# EAGLE design rosscomp_th (EAGLE 9.1.3)
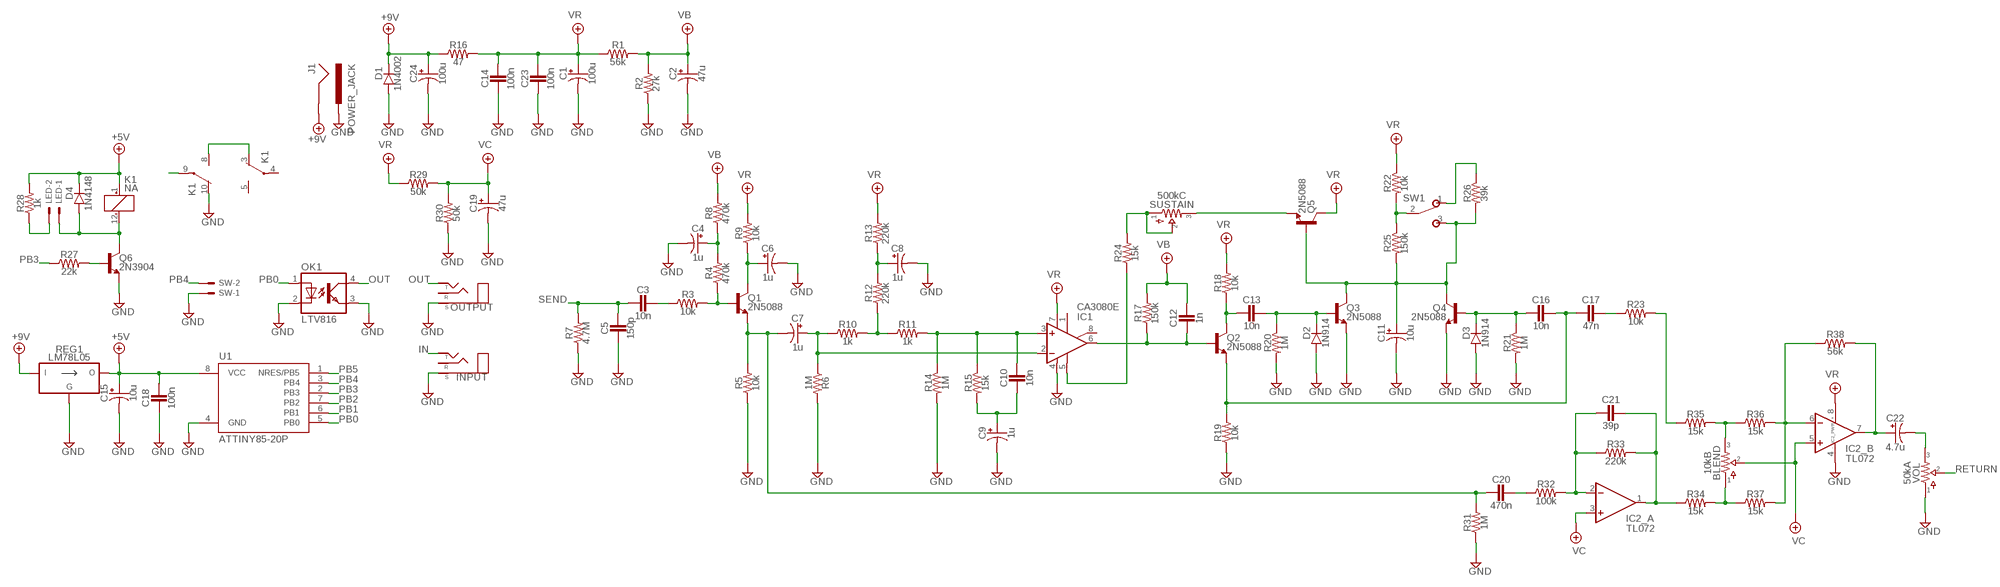
[diagram p0: schematic, sheet 1]

## Parts
BLEND  10kB  POTS16MM  [16MM]
C1  100u  0500  [050_020]
C2  47u  0500  [050_020]
C3  10n  CER/FILMBOX.1  [BOX_SMALL]
C4  1u  0400  [040_020]
C5  150p  CER/FILM2  [050X030_025_2]
C6  1u  0400  [040_020]
C7  1u  0400  [040_020]
C8  1u  0400  [040_020]
C9  1u  0400  [040_020]
C10  10n  CER/FILMBOX.1  [BOX_SMALL]
C11  10u  0500  [050_020]
C12  1n  CER/FILMBOX.1  [BOX_SMALL]
C13  10n  CER/FILMBOX.1  [BOX_SMALL]
C14  100n  CER/FILM2  [050X030_025_2]
C15  10u  0500  [050_020]
C16  10n  CER/FILMBOX.1  [BOX_SMALL]
C17  47n  CER/FILMBOX.1  [BOX_SMALL]
C18  100n  CER/FILM2  [050X030_025_2]
C19  47u  0500  [050_020]
C20  470n  CER/FILMBOX.2  [BOX_MED]
C21  39p  CER/FILM2  [050X030_025_2]
C22  4.7u  0500  [050_020]
C23  100n  CER/FILM2  [050X030_025_2]
C24  100u  0500  [050_020]
D1  1N4002  DO41.2  [DO41-2]
D2  1N914  DO35.2  [DO35-2]
D3  1N914  DO35.2  [DO35-2]
D4  1N4148  DO35.2  [DO35-2]
IC1  CA3080E  3080TH  [DIL0]
IC2  TL072  DUALTH  [DIL0]
INPUT  STEREONMJ  [NMJ6HCD2]
J1  POWER_JACK  [POWER_JACK_PTH]
K1  NA  [NA]
LED  JST-XH-02-PIN-ROUND-PAD  [JST-XH-02-PACKAGE-ROUND-PAD]
OK1  LTV816  [DIL04]
OUTPUT  STEREONMJ  [NMJ6HCD2]
Q1  2N5088  [TO92-]
Q2  2N5088  [TO92-]
Q3  2N5088  [TO92-]
Q4  2N5088  [TO92-]
Q5  2N5088  [TO92-]
Q6  2N3904  [TO92-]
R1  56k  R_.3B  [R0207/3]
R2  27k  R_.3B  [R0207/3]
R3  10k  R_.3B  [R0207/3]
R4  470k  R_.3B  [R0207/3]
R5  10k  R_.3B  [R0207/3]
R6  1M  R_.3B  [R0207/3]
R7  4.7M  R_.3B  [R0207/3]
R8  470k  R_.3B  [R0207/3]
R9  10k  R_.3B  [R0207/3]
R10  1k  R_.3B  [R0207/3]
R11  1k  R_.3B  [R0207/3]
R12  220k  R_.3B  [R0207/3]
R13  220k  R_.3B  [R0207/3]
R14  1M  R_.3B  [R0207/3]
R15  15k  R_.3B  [R0207/3]
R16  47  R_.3B  [R0207/3]
R17  150k  R_.3B  [R0207/3]
R18  10k  R_.3B  [R0207/3]
R19  10k  R_.3B  [R0207/3]
R20  1M  R_.3B  [R0207/3]
R21  1M  R_.3B  [R0207/3]
R22  10k  R_.3B  [R0207/3]
R23  10k  R_.3B  [R0207/3]
R24  15k  R_.3B  [R0207/3]
R25  150k  R_.3B  [R0207/3]
R26  39k  R_.3B  [R0207/3]
R27  22k  R_.3B  [R0207/3]
R28  1k  R_.3B  [R0207/3]
R29  50k  R_.3B  [R0207/3]
R30  50k  R_.3B  [R0207/3]
R31  1M  R_.3B  [R0207/3]
R32  100k  R_.3B  [R0207/3]
R33  220k  R_.3B  [R0207/3]
R34  15k  R_.3B  [R0207/3]
R35  15k  R_.3B  [R0207/3]
R36  15k  R_.3B  [R0207/3]
R37  15k  R_.3B  [R0207/3]
R38  56k  R_.3B  [R0207/3]
REG1  LM78L05  [TO92-]
SUSTAIN  500kC  POTS16MM  [16MM]
SW  JST-XH-02-PIN-ROUND-PAD  [JST-XH-02-PACKAGE-ROUND-PAD]
SW1  SPDT  [M9040P]
U1  ATTINY85-20P  [PDIP08_300MIL]
VOL  50kA  POTS16MM  [16MM]

## Nets
+5V: C15.+ C18.1 D4.C K1.1(1:+) R28.2 REG1.3(VO) U1.8(VCC)
+9V: C24.+ D1.C J1.GND R16.1 REG1.1(VI)
GND: C1.- C2.- C4.- C5.2 C6.- C8.- C9.- C11.- C14.1 C15.- C18.2 C19.- C23.1 C24.- D1.A D2.A D3.A IC1.4(V-) IC2.4(_PWR:V-) INPUT.S J1.PWR K1.10(3:O) OK1.2(C) OK1.3(EMIT) OUTPUT.S Q3.3(E) Q4.3(E) Q6.3(E) R2.1 R5.1 R6.2 R7.1 R14.2 R19.1 R20.2 R21.2 R30.1 R31.1 REG1.2(GND) SW.1 U1.4(GND) VOL.1
IN: INPUT.T
N$1: D4.A K1.12(1:-) LED.1 Q6.1(C)
N$2: C3.1 R3.1
N$3: Q1.2(B) R3.2 R4.1
N$4: Q6.2(B) R27.2
N$5: C4.+ R4.2 R8.1
N$6: R26.1 SW1.1(O)
N$7: C6.+ Q1.1(C) R9.1
N$8: C7.+ IC1.2(-IN) R6.1 R10.1
N$9: C7.- C20.2 Q1.3(E) R5.2 R31.2
N$10: C10.1 IC1.3(+IN) R11.2 R14.1 R15.1
N$11: R10.2 R11.1 R12.1
N$12: C8.+ R12.2 R13.1
N$13: C9.+ C10.2 R15.2
N$14: C13.2 Q2.1(C) R18.1
N$15: C12.2 IC1.6(OUT) Q2.2(B) R17.1
N$16: C16.1 C17.2 Q2.3(E) R19.2
N$17: C13.1 D2.C Q3.2(B) R20.1
N$18: C11.+ Q3.1(C) Q4.1(C) Q5.2(B) R25.2 R26.2 SW1.3(S)
N$19: C16.2 D3.C Q4.2(B) R21.1
N$20: R22.2 R25.1 SW1.2(P)
N$21: C17.1 R23.1
N$22: C20.1 R32.1
N$23: Q5.3(E) SUSTAIN.3
N$24: LED.2 R28.1
N$25: R24.2 SUSTAIN.1 SUSTAIN.2
N$26: IC1.5(OPT) R24.1
N$27: K1.3(2:O) K1.8(3:S)
N$28: C21.2 IC2.2(_A:-IN) R32.2 R33.1
N$29: C21.1 IC2.1(_A:OUT) R33.2 R34.1
N$30: BLEND.1 R34.2 R37.1
N$31: BLEND.3 R35.2 R36.1
N$32: K1.9(3:P)
N$34: R23.2 R35.1
N$35: C22.+ IC2.7(_B:OUT) R38.2
N$36: C22.- VOL.3
N$37: IC2.6(_B:-IN) R36.2 R37.2 R38.1
OUT: OK1.4(COL) OUTPUT.T
PB0: OK1.1(A) U1.5(PB0)
PB1: U1.6(PB1)
PB2: U1.7(PB2)
PB3: R27.1 U1.2(PB3)
PB4: SW.2 U1.3(PB4)
PB5: U1.1(NRES/PB5)
RETURN: VOL.2
SEND: C3.2 C5.1 R7.2
VB: C2.+ C12.1 R1.2 R2.2 R8.2 R17.2
VC: BLEND.2 C19.+ IC2.3(_A:+IN) IC2.5(_B:+IN) R29.2 R30.2
VR: C1.+ C14.2 C23.2 IC1.7(V+) IC2.8(_PWR:V+) Q5.1(C) R1.1 R9.2 R13.2 R16.2 R18.2 R22.1 R29.1
Unconnected: IC1.1(ON1) IC1.8(ON2) INPUT.R K1.4(2:P) K1.5(2:S) OUTPUT.R

## Library data of the parts
BLEND SUSTAIN VOL = pedals-potentiometers:POTS
C1 C2 C11 C15 C19 C22 C24 = pedals-capacitors-elec:050
C3 C5 C10 C12-C14 C16-C18 C20 C21 C23 = pedals-capacitors-film:CER/FILM: 47 - 120pF Xicon Ceramic Disc 2.5mm lead spacing
C4 C6-C9 = pedals-capacitors-elec:040
D1 = pedals-diodes:DO41: DO-41 Package Diodes: 1N4001 - 1N40019 Zener Diodes: 1N4728 - 1N4764
D2-D4 = pedals-diodes:DO35: DO-35 Package Diodes: 1N914
IC1 = pedals-integrated circuits:3080: OP AMP
IC2 = pedals-integrated circuits:DUAL: OP AMP
INPUT OUTPUT = pedals-jacks:STEREO
J1 = pedals-jacks:POWER_JACK: Power Jack Connector This is the standard 5.5mm barrel jack for power. The PTH is the most common, proven, reliable, footprint. The Slot footprint only works if the mill layer is transmitted to the PCB fab house so be warned. Here are the connectors we sell at SparkFun: DC Barrel Power Jack/Connector <https://www.sparkfun.com/products/119> (PRT-00119) DC Barrel Power Jack/Connector (SMD) <https://www.sparkfun.com/products/12748> (PRT-12748) DC Barrel Jack Adapter - Breadboard Compatible <https://www.sparkfun.com/products/10811> (PRT-10811) It is used on this SparkFun product (and many, many others): SparkFun RedBoard - Programmed with Arduino <https://www.sparkfun.com/products/12757> (DEV-12757) Also, if you need a mating power supply or connector, please check these out: Wall Adapter Power Supply - 9VDC 650mA <https://www.sparkfun.com/products/298> (TOL-00298) DC Barrel Jack Adapter - Male <https://www.sparkfun.com/products/10287> (PRT-10287); PROD_ID: CONN-08197
K1 = pedals-relays:NA: RELAY; OC_FARNELL: unknown; OC_NEWARK: unknown
LED SW = pedals-headers:JST-XH-02-PIN: JST XH Connector 2 Pin Wire to board connector. Pitch: 2,54 mm, (0.100") Number of pins: 2 Created by Rembrandt Electronics www.rembrandtelectronics.com
OK1 = pedals-integrated circuits:LTV816: OPTO COUPLER Source: LITEON, LTV816.pdf; OC_FARNELL: unknown; OC_NEWARK: unknown
Q1-Q5 = pedals-transistors:2N5088: NPN Transistor
Q6 = pedals-transistors:2N3904: NPN Transistor
R1-R38 = pedals-resistors:R_
REG1 = pedals-regulators:LM78L05
SW1 = pedals-switches:SPDT: TOGGLE SWITCH Marquardt
U1 = pedals-microcontrollers:ATTINY85*: ATMEL ATtiny 85 Packages: P = PDIP 08 30mil S = SOIC 08 EIAJ 208mil Technologies Note: for complete ordering code (temp. range, finish, tape&reel etc.) see www.atmel.com • Supply Voltage: V = (1.8…5.5)V | [blank] = (2.7…5.5)V • Speed: 10 = 10 MHz | 20 = 20 MHz Author: Dipl.-Ing. FH Rainer Bayer HHN Hochschule Heilbronn (Heilbronn University), rainer.bayer@hs-heilbronn.de Ingenieurbüro ing-rb, mail@ing-rb.de

## Board
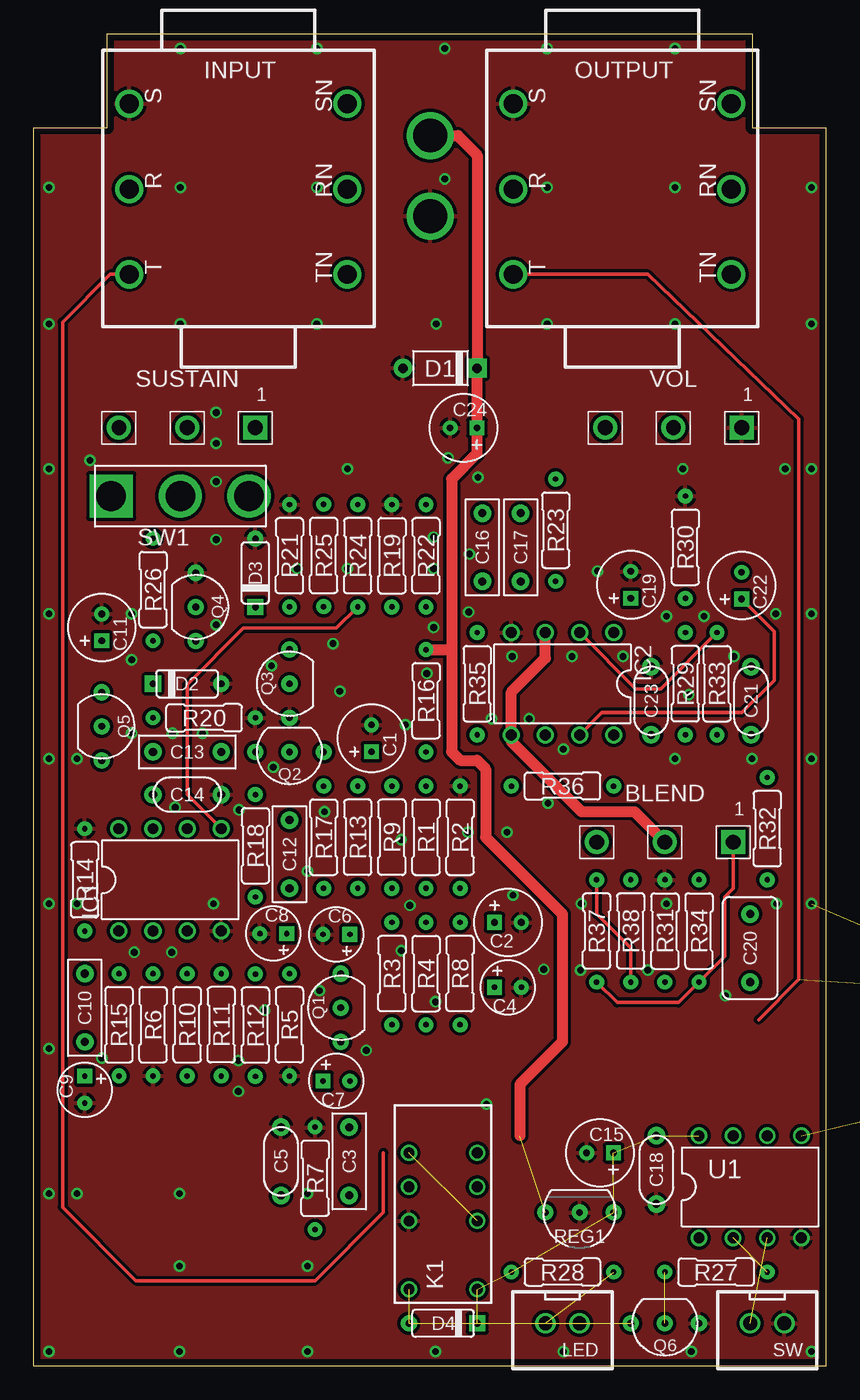
[diagram p1: board, top side]
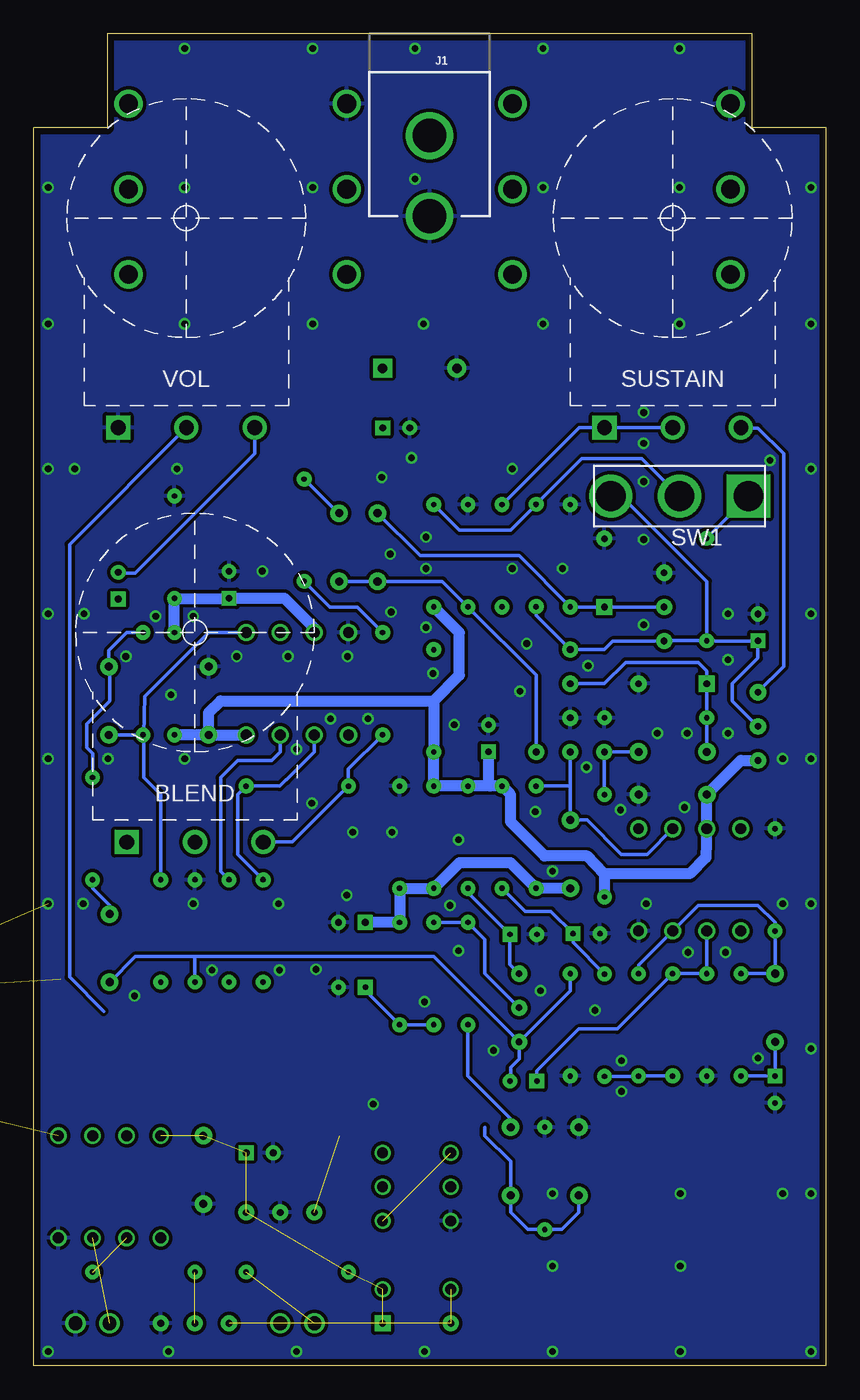
[diagram p2: board, bottom side, seen from below]

Size 59 x 99.21 mm. Coordinates in mm from the lower left corner, seen from the top.
Copper layers (1*16): Top 0.035mm / dielectric 1.6mm / Bottom 0.035mm
Design rules "Elecrow_2-layer_PCB_eagle_rule": minimum track width 6mil, minimum drill 12mil, track to track 6mil, track to pad 6mil, pad to pad 6mil, via to via 8mil, smd to smd 0mil, copper to edge 20mil, drill to drill 10mil, minimum pad ring 6mil, minimum via ring 6mil, stop-mask expansion 0mil, vias tented up to drill 100mil, thermal gap 10mil

### Footprints (pad centres in the part's own frame; a part is rotated, then mirrored left to right if it is on the bottom)
16MM = drill 1.1 pad 1.8 square: 1 5.08,-1 | drill 1.1 pad 1.8: 2 0,-1; 3 -5.08,-1
050_020 = drill 0.5 pad 1.1 square: + -0.998,0.001 | drill 0.5 pad 1.1: - 0.998,0.001
BOX_SMALL = drill 0.6 pad 1.3: 1 -2.54,0; 2 2.54,0
040_020 = drill 0.4 pad 1.1 square: + -1.001,0 | drill 0.4 pad 1.1: - 1.001,0
050X030_025_2 = drill 0.6 pad 1.3: 1 -2.54,0; 2 2.54,0
BOX_MED = drill 0.6 pad 1.3: 1 -2.54,0; 2 2.54,0
DO41-2 = drill 0.7 pad 1.4: A 2.794,0 | drill 0.7 pad 1.4 square: C -2.731,0
DO35-2 = drill 0.5 pad 1.2: A 2.54,0 | drill 0.5 pad 1.2 square: C -2.54,0
DIL0 = drill 0.813 pad 1.27: 1 -3.81,-3.81; 2 -1.27,-3.81; 3 1.27,-3.81; 4 3.81,-3.81; 5 3.81,3.81; 6 1.27,3.81; 7 -1.27,3.81; 8 -3.81,3.81
NMJ6HCD2 = drill 1.4: R 0,8.115; RN 0,-8.115; S 6.35,8.115; SN 6.35,-8.115; T -6.35,8.115; TN -6.35,-8.115
POWER_JACK_PTH = drill 2.5: GND 0,7.7; PWR 0,13.7
NA = drill 0.8: 1 -6.35,-2.54; 3 -1.27,-2.54; 4 1.27,-2.54; 5 3.81,-2.54; 8 3.81,2.54; 9 1.27,2.54; 10 -1.27,2.54; 12 -6.35,2.54
JST-XH-02-PACKAGE-ROUND-PAD = drill 1.016: 1 -1.27,0; 2 1.27,0
DIL04 = drill 0.813 pad 1.27: 1 -1.27,-3.81; 2 1.27,-3.81; 3 1.27,3.81; 4 -1.27,3.81
TO92- = drill 0.5 pad 1.2: 1 2.54,0; 2 0,0; 3 -2.54,0
R0207/3 = drill 0.4 pad 1.1: 1 -3.81,0; 2 3.81,0
TO92-' = drill 0.5 pad 1.194: 1 -2.54,0; 2 0,0; 3 2.54,0
M9040P = drill 2.2 pad 2.9 square: 1 5.144,0 | drill 2.2 pad 2.9: 2 0,0; 3 -5.118,0
PDIP08_300MIL = drill 0.813: 1 -3.81,-3.81; 2 -1.27,-3.81; 3 1.27,-3.81; 4 3.81,-3.81; 5 3.81,3.81; 6 1.27,3.81; 7 -1.27,3.81; 8 -3.81,3.81

### Placement (x,y rotation side)
BLEND  46.99,40.01 0 top
C1  25.15,46.74 90 top
C2  35.31,33.02 0 top
C3  23.5,15.24 270 top
C4  35.31,28.19 0 top
C5  18.41,15.24 90 top
C6  22.54,32.13 180 top
C7  22.54,21.21 0 top
C8  17.84,32.19 180 top
C9  3.81,20.57 270 top
C10  3.81,26.67 270 top
C11  5.08,54.99 90 top
C12  19.05,38.1 90 top
C13  11.43,45.72 0 top
C14  11.43,42.55 180 top
C15  42.16,15.88 180 top
C16  33.4,60.96 90 top
C17  36.26,60.96 270 top
C18  46.35,14.61 270 top
C19  44.45,58.17 90 top
C20  53.34,31.12 270 top
C21  53.4,49.53 90 top
C22  52.7,58.1 90 top
C23  45.97,49.53 270 top
C24  32,69.85 180 top
D1  30.29,74.3 180 top
D2  11.43,50.8 0 top
D3  16.51,59.05 90 top
D4  30.48,3.18 180 top
IC1  10.16,36.2 0 top
IC2  39.37,50.8 180 top
INPUT  15.24,87.63 90 top
J1  29.53,99.31 180 bottom
K1  30.48,12.07 90 top
LED  39.37,3.18 180 top
OK1  71.75,24.13 0 top  (outside the outline)
OUTPUT  43.81,87.63 90 top
Q1  22.86,26.67 90 top
Q2  19.05,45.72 180 top
Q3  19.05,50.8 90 top
Q4  12.06,56.52 270 top
Q5  5.08,47.62 270 top
Q6  46.99,3.18 180 top
R1  29.21,39.37 270 top
R2  31.75,39.37 270 top
R3  26.67,29.21 90 top
R4  29.21,29.21 270 top
R5  19.05,25.4 90 top
R6  8.89,25.4 270 top
R7  20.95,13.97 270 top
R8  31.75,29.21 90 top
R9  26.67,39.37 90 top
R10  11.43,25.4 270 top
R11  13.97,25.4 90 top
R12  16.51,25.38 90 top
R13  24.13,39.37 90 top
R14  3.81,36.2 90 top
R15  6.35,25.4 270 top
R16  29.21,49.53 270 top
R17  21.59,39.37 270 top
R18  16.51,38.73 270 top
R19  26.67,60.33 270 top
R20  12.7,48.26 0 top
R21  19.05,60.33 90 top
R22  29.21,60.33 90 top
R23  38.86,62.23 270 top
R24  24.13,60.33 90 top
R25  21.59,60.35 270 top
R26  8.89,57.81 270 top
R27  50.8,6.99 180 top
R28  39.37,6.99 180 top
R29  48.51,50.8 90 top
R30  48.51,60.96 270 top
R31  46.99,32.39 270 top
R32  54.61,40.01 90 top
R33  50.86,50.8 270 top
R34  49.53,32.39 270 top
R35  33.02,50.8 270 top
R36  39.37,43.18 0 top
R37  41.91,32.39 90 top
R38  44.45,32.39 90 top
REG1  LM78L05  [TO92-']  40.64,11.43 0 top
SUSTAIN  11.43,70.87 0 top
SW  54.61,3.18 180 top
SW1  10.92,64.77 180 top
U1  53.34,13.34 0 top
U$2  [125B_PCB_HUGER]  0,11.43 0 top
VOL  47.62,70.87 0 top

### Tracks (layer width: path | path; a pad name or v marks a point on that pad's centre or on a via)
+5V  (6 unrouted)
+9V  (1 unrouted)
  Top 0.813: J1.GND 31.58,91.61 33.02,90.17 D1.C 33,74.28 C24.+ 33,67.93 31.11,66.04 31.11,53.34 | 31.11,53.34 31.11,45.72 31.75,45.09 33.02,45.09 33.66,44.45 33.66,39.37 39.37,33.66 39.37,24.13 36.2,20.96 36.2,17.15 | R16.1 31.11,53.34
GND  (via drill 0.5 pad 0.85)  (2 unrouted)
  other vias: 1.14,77.6 1.14,1.08 1.14,87.76 1.14,66.8 1.14,56.01 1.14,45.21 1.14,34.42 1.14,23.62 1.14,12.83 57.91,77.6 57.91,1.08 57.91,87.76 57.91,66.8 57.91,56.01 57.91,45.21 57.91,34.42 10.92,98.11 21.08,98.11 30.61,98.11 10.92,87.76 10.92,77.6 21.08,87.76 21.08,77.6 30.61,88.39 38.23,98.11 47.75,98.11 38.23,87.76 47.75,87.76 47.75,77.6 38.23,77.6 29.97,77.6 10.86,1.08 20.38,1.08 48.96,1.08 39.43,1.08 29.91,1.08 20.38,7.43 10.86,7.43 3.24,12.83 3.24,34.42 5.08,22.92 3.24,45.21 4.19,67.44 40.77,34.42 35.69,35.05 47.12,34.42 55.31,34.42 55.94,66.8 29.91,27.11 27.69,47.75 29.27,51.56 41.97,59.18 12.57,47.12 10.35,47.12 22.29,53.78 33.08,66.17 30.86,67.63 32.45,60.45 29.78,61.72 29.78,59.37 33.72,19.49 37.97,29.53 40.7,29.46 45.72,29.46 51.5,27.56 27.37,30.92 27.37,39.18 52.13,52.83 19.62,59.37 13.4,34.42 32.32,39.75 35.24,39.75 7.3,52.58 13.59,65.85 13.59,68.71 13.59,70.99 17.21,26.48 15.3,41.4 10.54,41.59 21.65,41.28 29.78,54.99 32.38,56.13 24.77,23.5 13.59,55.18 53.47,45.21 43.88,52.83 40.07,52.83 35.62,52.83 55.24,56.01 10.86,12.83 20.38,12.83 7.3,56.01 34.1,48.2 36.89,48.2 48.77,49.97 49.91,55.82 47.12,55.82 48.32,66.8 23.37,66.8 21.27,27.94 7.49,30.8 10.29,30.8 15.24,20.45 15.24,22.73 28,34.29 23.37,59.37 47.75,45.21 39.43,45.91 17.84,44.58 17.72,52.13 22.8,50.23 38.29,41.91 13.59,61.53 20.38,36.83 7.3,47.12
  pour Bottom (isolate 0.254): 0,100.33 0,-2.54 59.05,-2.54 59.05,100.33
  pour Top (isolate 0.254): -0.64,-0.63 59.69,-0.63 59.69,100.33 -0.64,100.33
IN
  Top 0.254: INPUT.T 5.71,81.28 2.16,77.72 2.16,11.81 7.62,6.35 20.95,6.35 26.04,11.43 26.04,15.88
N$1  (3 unrouted)
N$2
  Bottom 0.254: C3.1 23.5,18.41 26.67,21.59 R3.1
N$3
  Bottom 0.254: R4.1 R3.2 25.4,31.75 25.4,29.21 Q1.2
N$4  (1 unrouted)
N$5
  Bottom 0.254: R4.2 R8.1 34.3,27.96 C4.+
N$6
  Bottom 0.254: SW1.1 8.89,61.66 R26.1
N$7
  Bottom 0.254: R9.1 26.67,35.26 C6.+ 23.54,29.89 Q1.1
N$8
  Bottom 0.254: IC1.2 R6.1 R10.1 15.56,25.08 18.41,25.08 21.54,21.96 C7.+
N$9
  Bottom 0.254: C20.2 51.44,30.48 46.99,30.48 | R31.2 46.99,30.48 | 46.99,30.48 29.21,30.48 Q1.3 | R5.2 19.05,27.94 Q1.3 | C7.- 23.5,21.26 23.5,22.23 22.86,22.86 Q1.3
N$10
  Bottom 0.254: R15.1 C10.1 R14.1 3.81,33.02 5.08,34.29 9.53,34.29 IC1.3 13.97,29.85 R11.2
N$11
  Bottom 0.254: R10.2 R11.1 13.99,21.57 R12.1
N$12
  Bottom 0.254: R12.2 18.84,31.52 C8.+ 20.5,33.84 22.42,33.84 R13.1
N$13
  Bottom 0.254: C10.2 C9.+ 4.49,21.59 R15.2
N$14
  Bottom 0.254: C13.2 Q2.1 R18.1
N$15
  Bottom 0.254: Q2.2 19.05,43.18 | 19.05,43.18 C12.2 17.78,40.64 15.24,38.1 13.34,38.1 IC1.6 | 19.05,43.18 R17.1
N$16
  Bottom 0.254: C17.2 C16.1 28.57,58.42 R19.2 21.59,51.44 Q2.3
N$17
  Bottom 0.254: C13.1 R20.1 D2.C 8.89,51.75 9.53,52.39 14.92,52.39 16.51,50.8 Q3.2
N$18
  Bottom 0.254: C11.+ | C11.+ R26.2 | R26.2 12.04,54 Q4.1 15.88,53.98 16.51,53.34 Q3.1 21.59,55.88 R25.2 | Q5.2 6.99,49.53 6.99,50.8 5.08,52.7 C11.+ | R26.2 8.89,58.42 15.24,64.77 SW1.3
N$19
  Bottom 0.254: Q4.2 D3.C R21.1 22.86,60.33 30.23,60.33 C16.2
N$20
  Bottom 0.254: R22.2 27.3,62.23 23.5,62.23 21.59,64.14 R25.1 18.19,67.56 13.72,67.56 SW1.2
N$21
  Bottom 0.254: R23.1 36.32,63.5 C17.1
N$22
  Bottom 0.254: C20.1 53.34,34.29 54.61,35.56 R32.1
N$23
  Bottom 0.254: Q5.3 3.17,52.07 3.17,67.95 5.08,69.85 6.33,69.85 SUSTAIN.3
N$24  (1 unrouted)
N$25
  Bottom 0.254: SUSTAIN.2 SUSTAIN.1 18.4,69.87 R24.2
N$26
  Top 0.254: IC1.5 11.43,42.55 11.43,50.74 15.62,54.93 22.54,54.93 R24.1
N$27  (1 unrouted)
N$28
  Top 0.254: IC2.2 44.83,50.42 46.67,50.42 R33.1
  Bottom 0.254: R33.1 52.07,54.61 53.4,53.28 C21.2 53.34,52.01 53.34,49.53 55.05,47.81 55.05,46.04 54.61,45.59 R32.2
N$29
  Bottom 0.254: R34.1 49.53,42.55 50.8,43.81 50.8,46.93 R33.2 | R33.2 50.8,47.05 50.74,49.85 45.97,54.61 IC2.1 | R33.2 C21.1
N$30
  Top 0.254: BLEND.1 52.07,35.56 51.44,34.93 51.44,30.48 R34.2 48.01,27.05 43.43,27.05 R37.1
N$31
  Bottom 0.254: R35.2 35.56,44.45 R36.1 39.73,39.01 BLEND.3
N$34
  Bottom 0.254: R35.1 34.92,56.52 36.96,56.52 R23.2
N$35
  Top 0.254: IC2.7 42.29,48.64 52.7,48.64 55.12,51.05 55.12,54.69 C22.+
  Bottom 0.254: IC2.7 40.64,45.72 41.27,45.09 43.81,45.09 45.09,43.81 45.09,36.83 R38.2
N$36
  Bottom 0.254: VOL.3 42.55,67.95 51.44,59.05 52.66,59.05 C22.-
N$37
  Top 0.254: R37.2 41.91,33.66 44.45,31.12 R38.1
  Bottom 0.254: R37.2 43.81,38.1 43.81,42.55 R36.2 40.68,43.18 40.23,43.63 40.19,43.63 38.1,45.72 IC2.6
OUT  (1 unrouted)
  Top 0.254: 53.98,25.78 56.96,28.77 56.96,70.48 45.72,81.28 OUTPUT.T
PB0  (1 unrouted)
PB3  (1 unrouted)
PB4  (1 unrouted)
RETURN
  Bottom 0.254: 53.78,26.42 56.33,28.96 56.33,61.17 VOL.2
SEND
  Bottom 0.254: 25.4,17.78 25.4,17.15 23.5,15.24 C3.2 23.5,11.43 22.23,10.16 R7.2 19.68,10.16 18.41,11.43 C5.1
VB
  Bottom 0.813: C2.+ R8.2 R2.2 R1.2 27.3,37.47 23.5,37.47 R17.2 C12.1
VC
  Top 0.813: IC2.3 38.1,52.7 35.56,50.17 IC2.5 35.56,46.48 40.77,41.28 44.72,41.28 BLEND.2
  Bottom 0.813: IC2.3 38.1,54.93 40.34,57.17 C19.+ 44.47,57.15 R30.2 R29.2
VR
  Bottom 0.813: 25.02,43.18 R13.2 23.5,42.55 23.5,40.51 20.95,37.97 17.78,37.97 16.51,36.64 | 25.02,43.18 R9.2 R1.1 R16.2 29.21,49.53 | 16.51,36.64 10.16,36.64 8.95,37.85 IC1.7 C14.2 6.35,45.09 Q5.1 | 16.51,36.64 R18.2 | 29.21,49.53 27.3,51.44 27.3,54.61 R22.1 | C23.2 IC2.8 | C23.2 R29.1 | 29.21,49.53 45.09,49.53 45.97,48.64 C23.2 | C1.+ 25.14,43.31 25.02,43.18